# EAGLE schematic 519_jetson_nano_020100 (EAGLE 9.6.2)
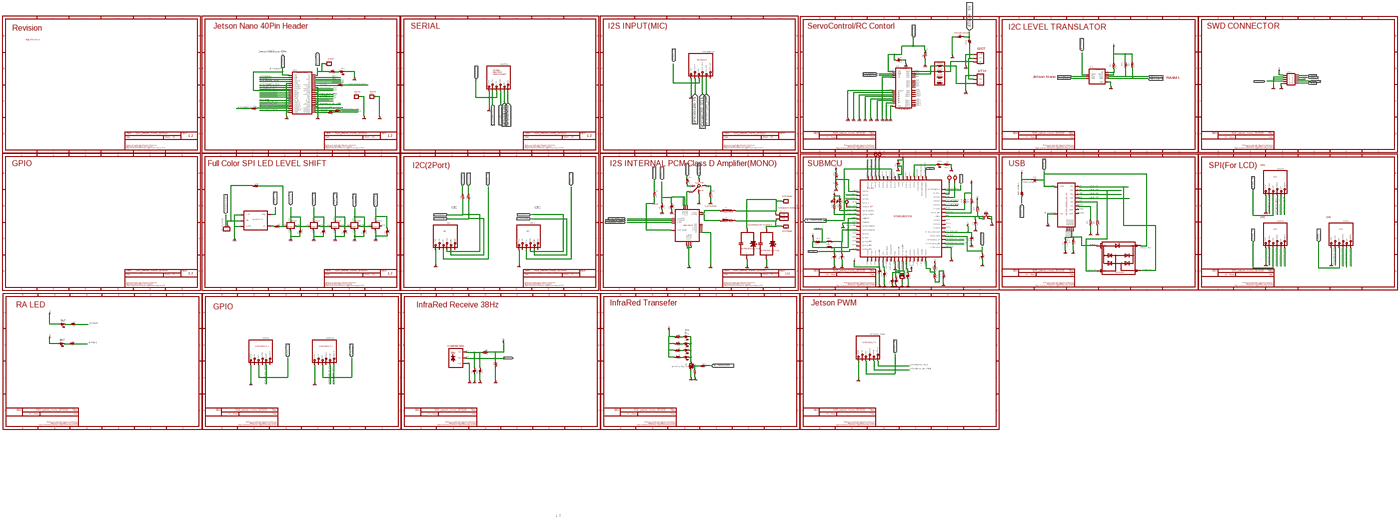
[diagram p0: schematic, sheet 1, overview]
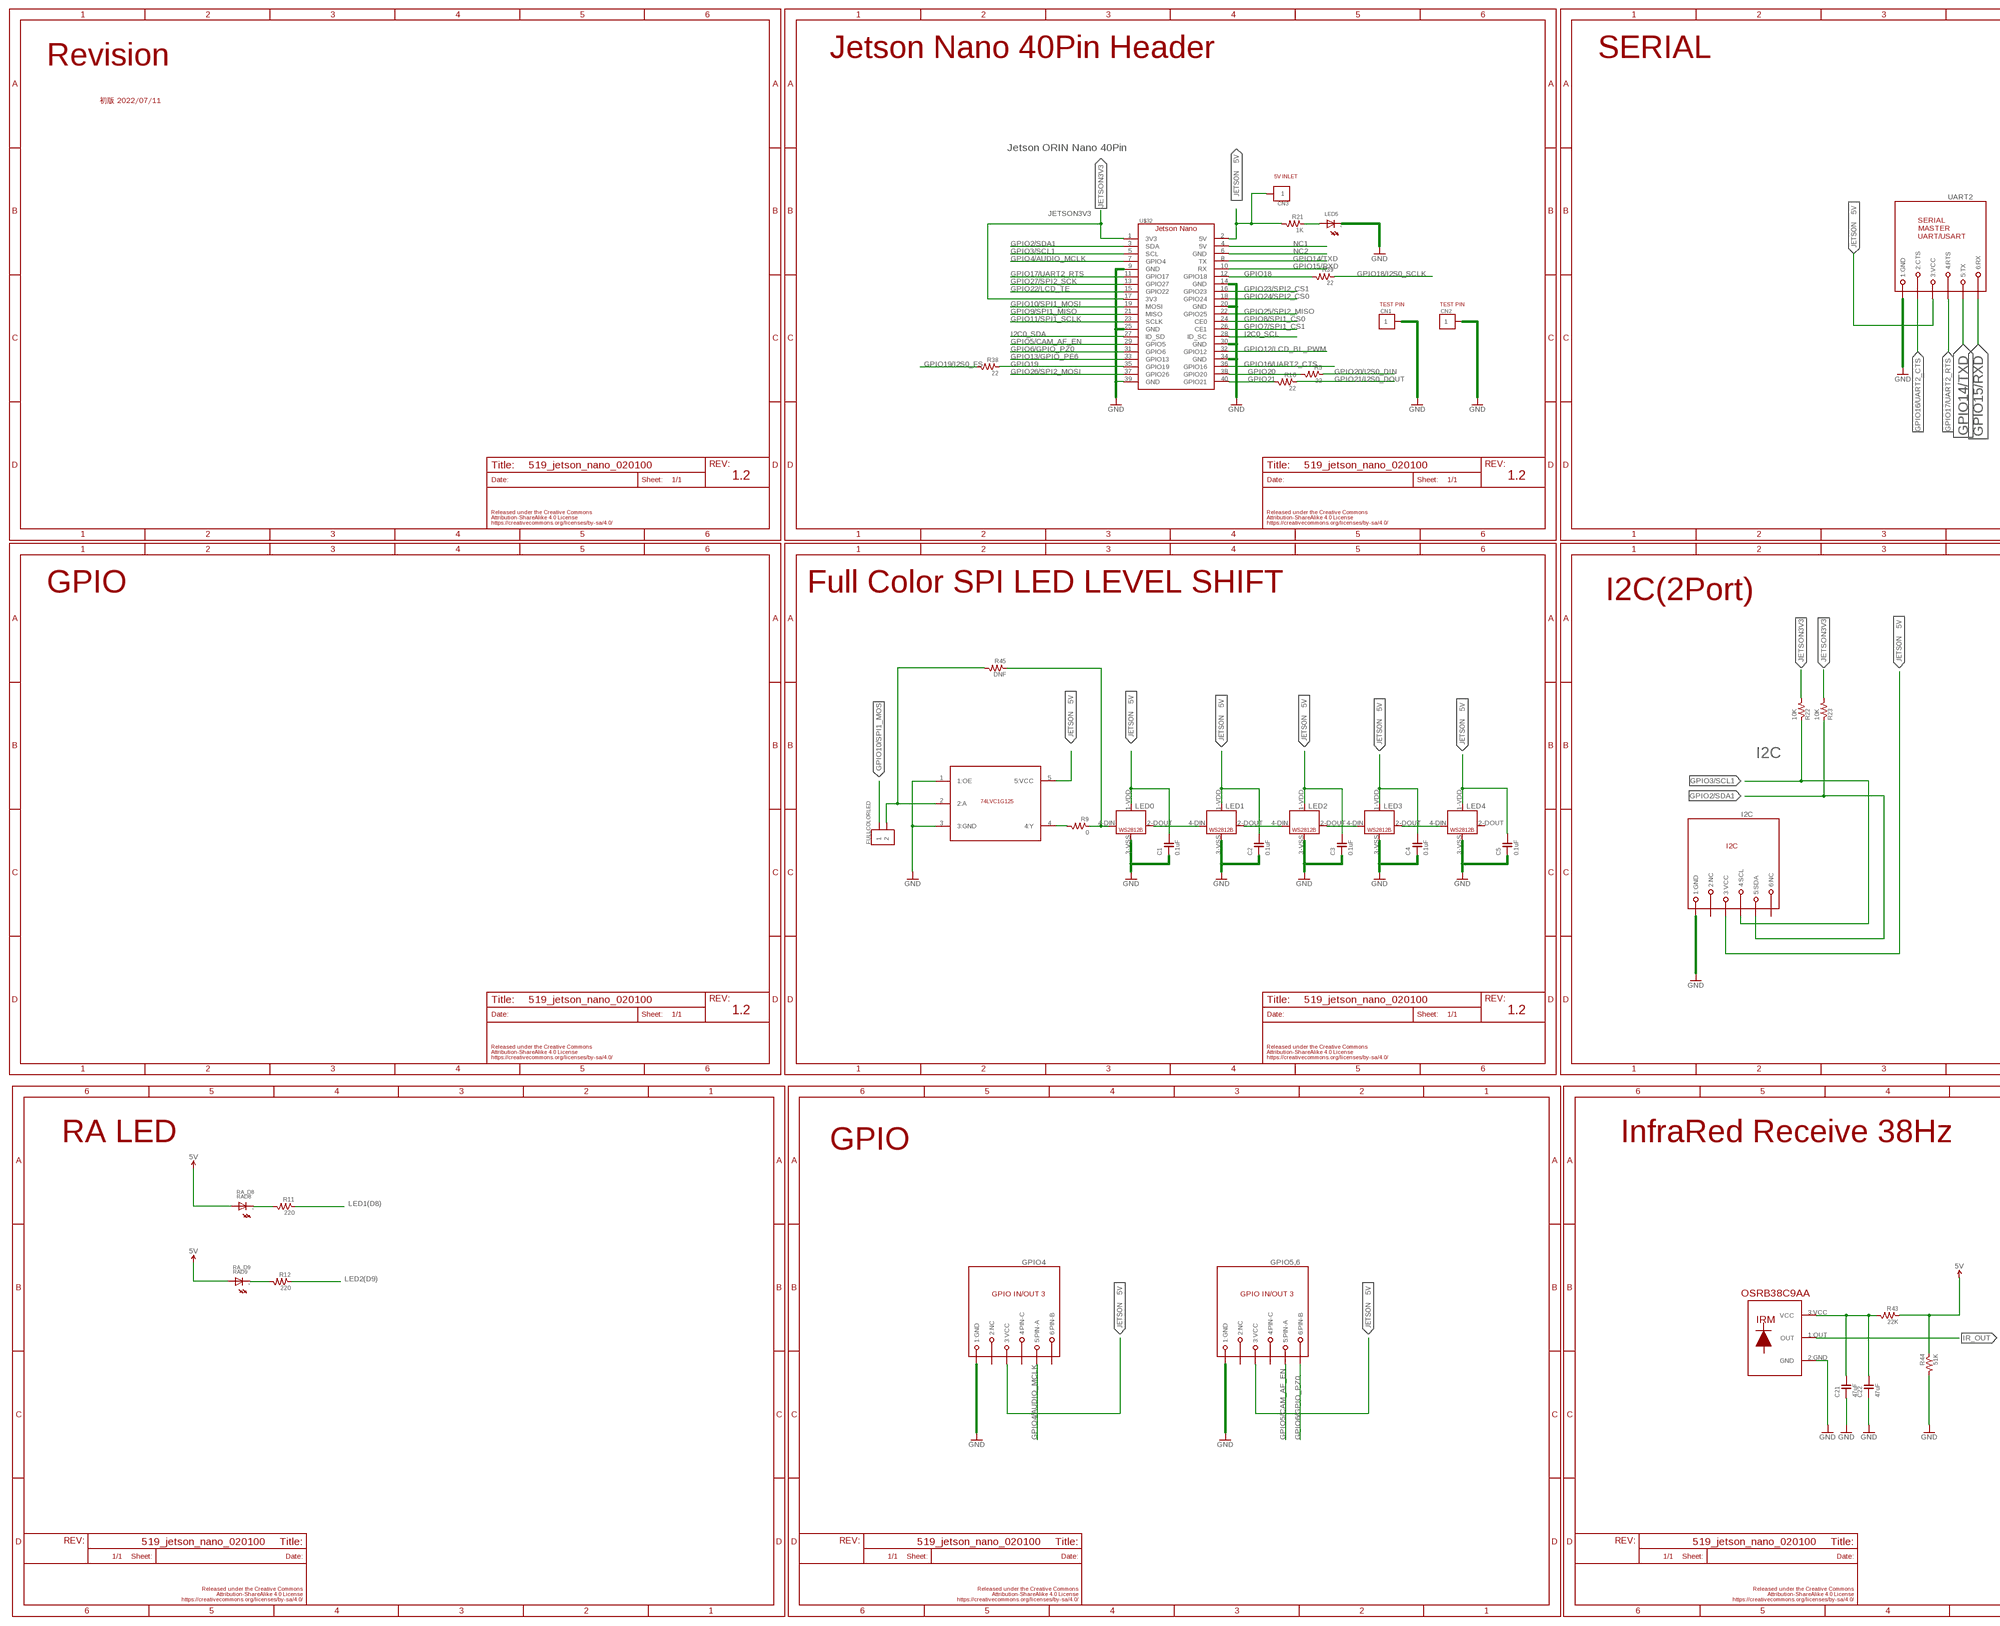
[diagram p1: schematic, sheet 1, part 1 of 4]
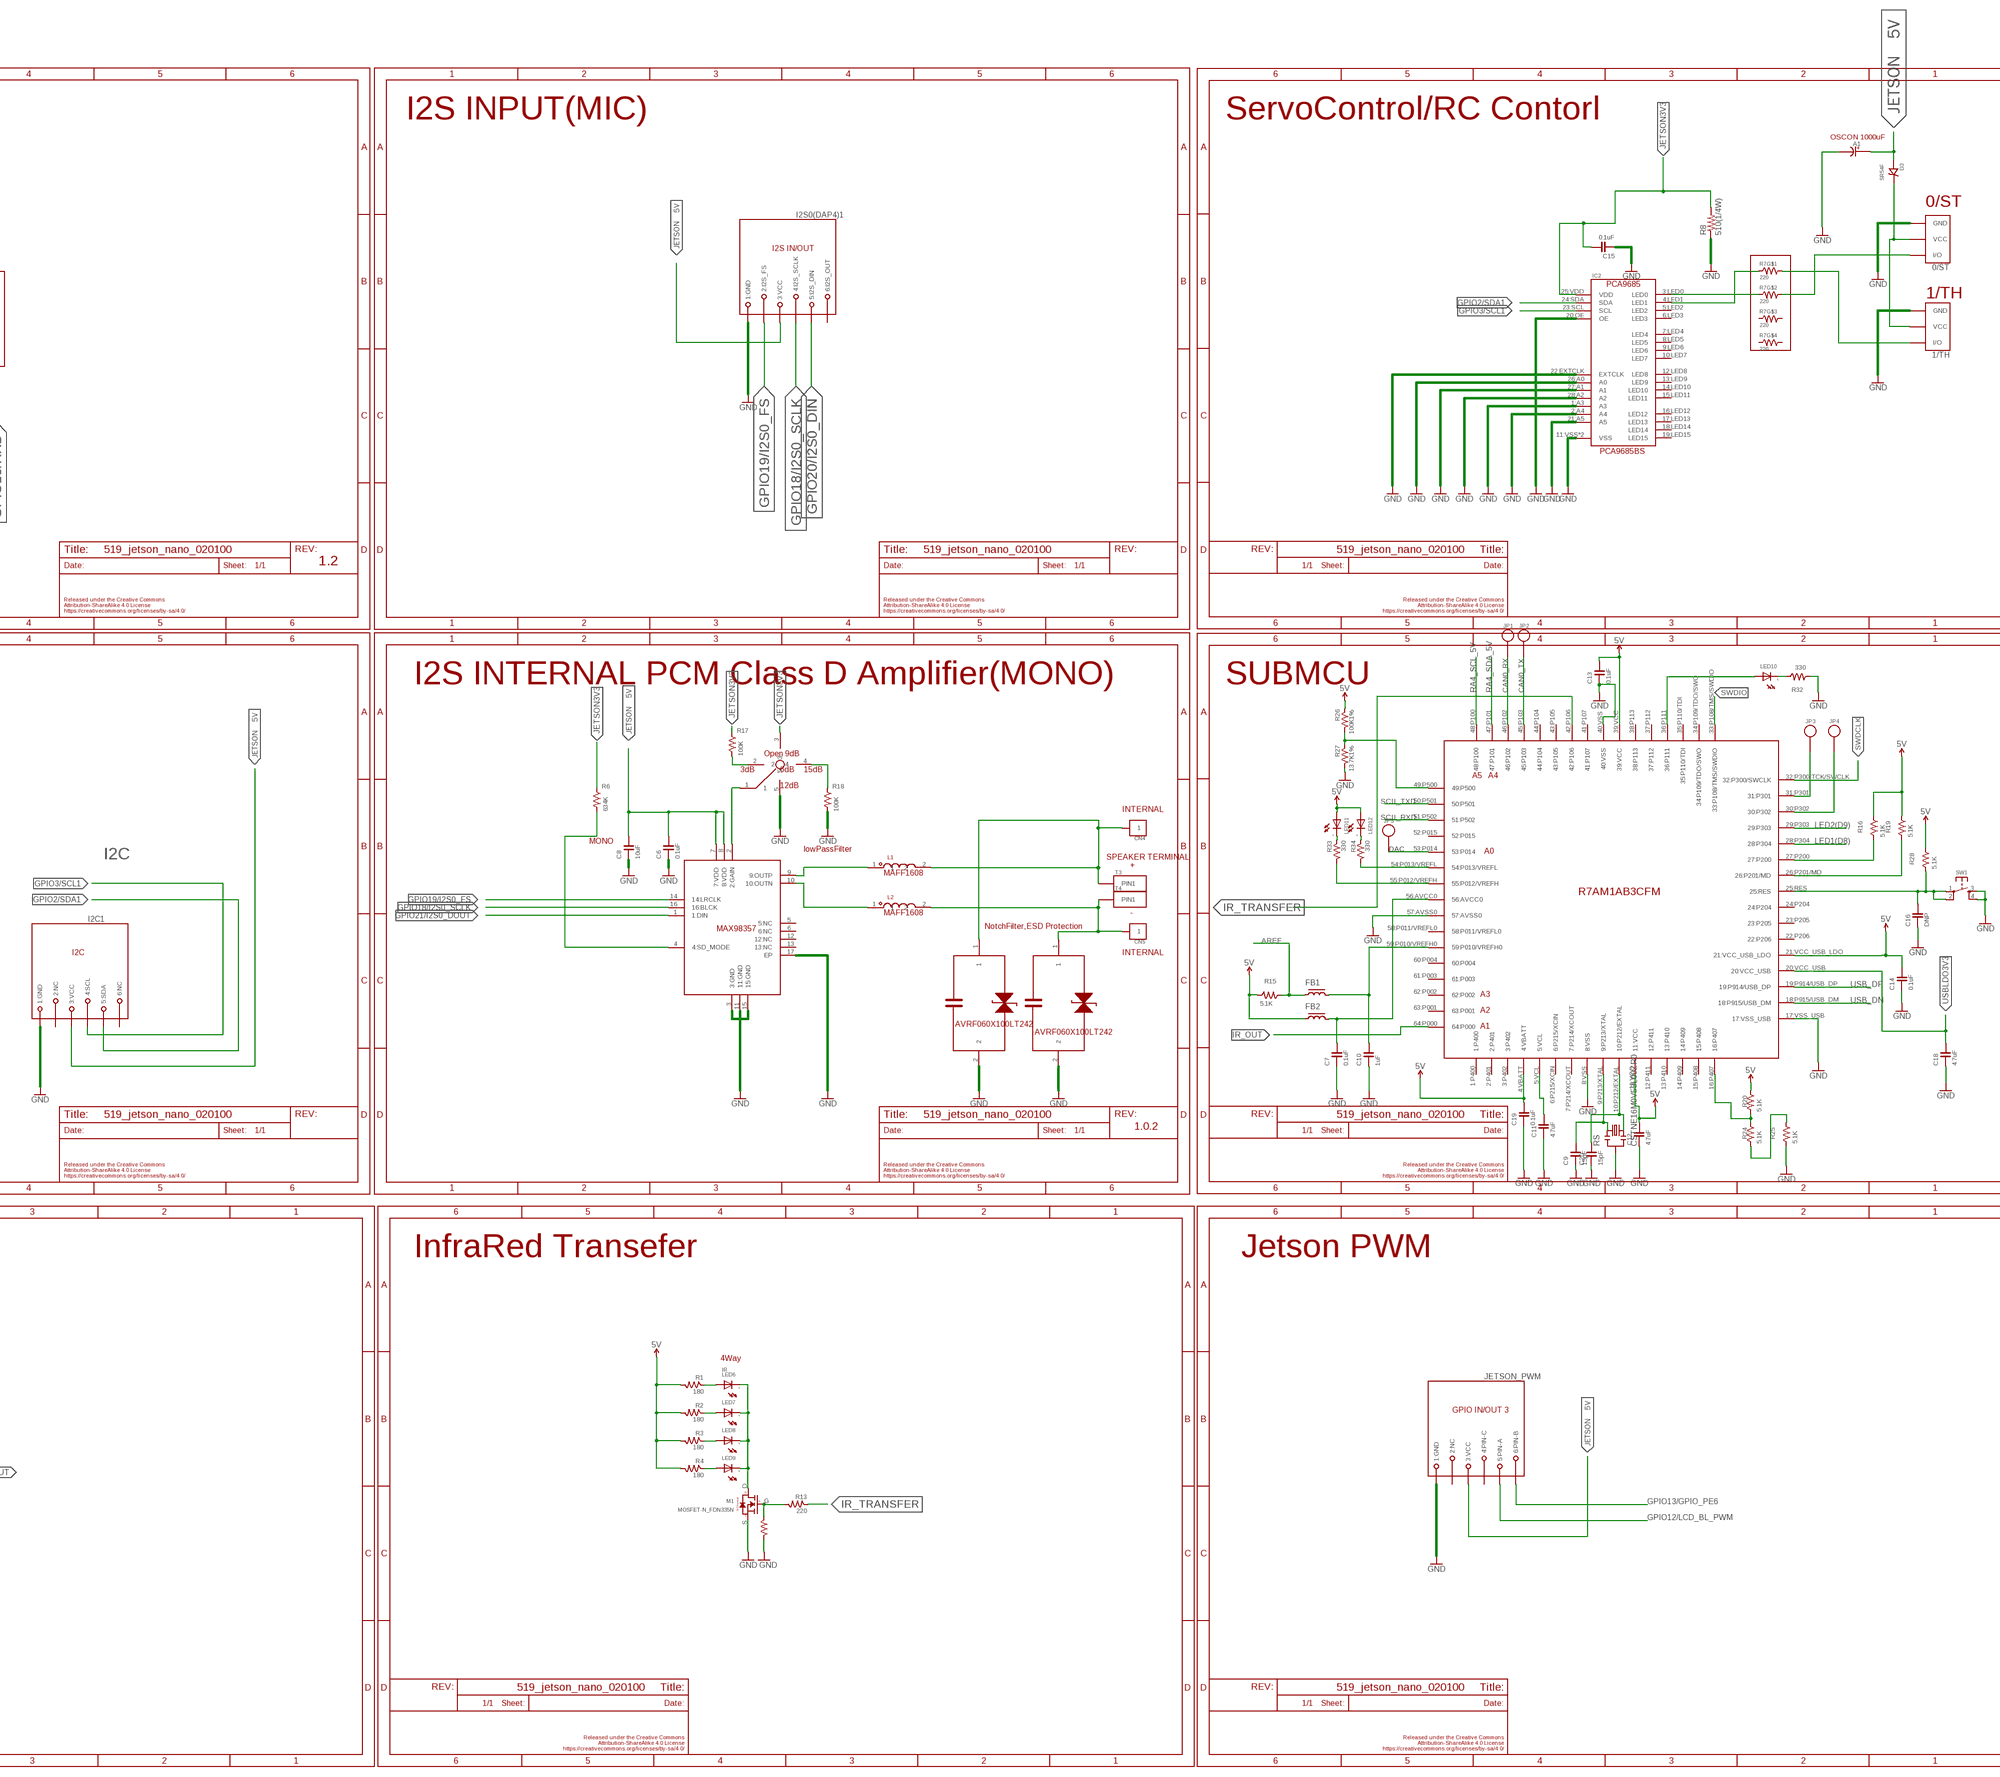
[diagram p2: schematic, sheet 1, part 2 of 4]
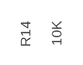
[diagram p3: schematic, sheet 1, part 3 of 4]
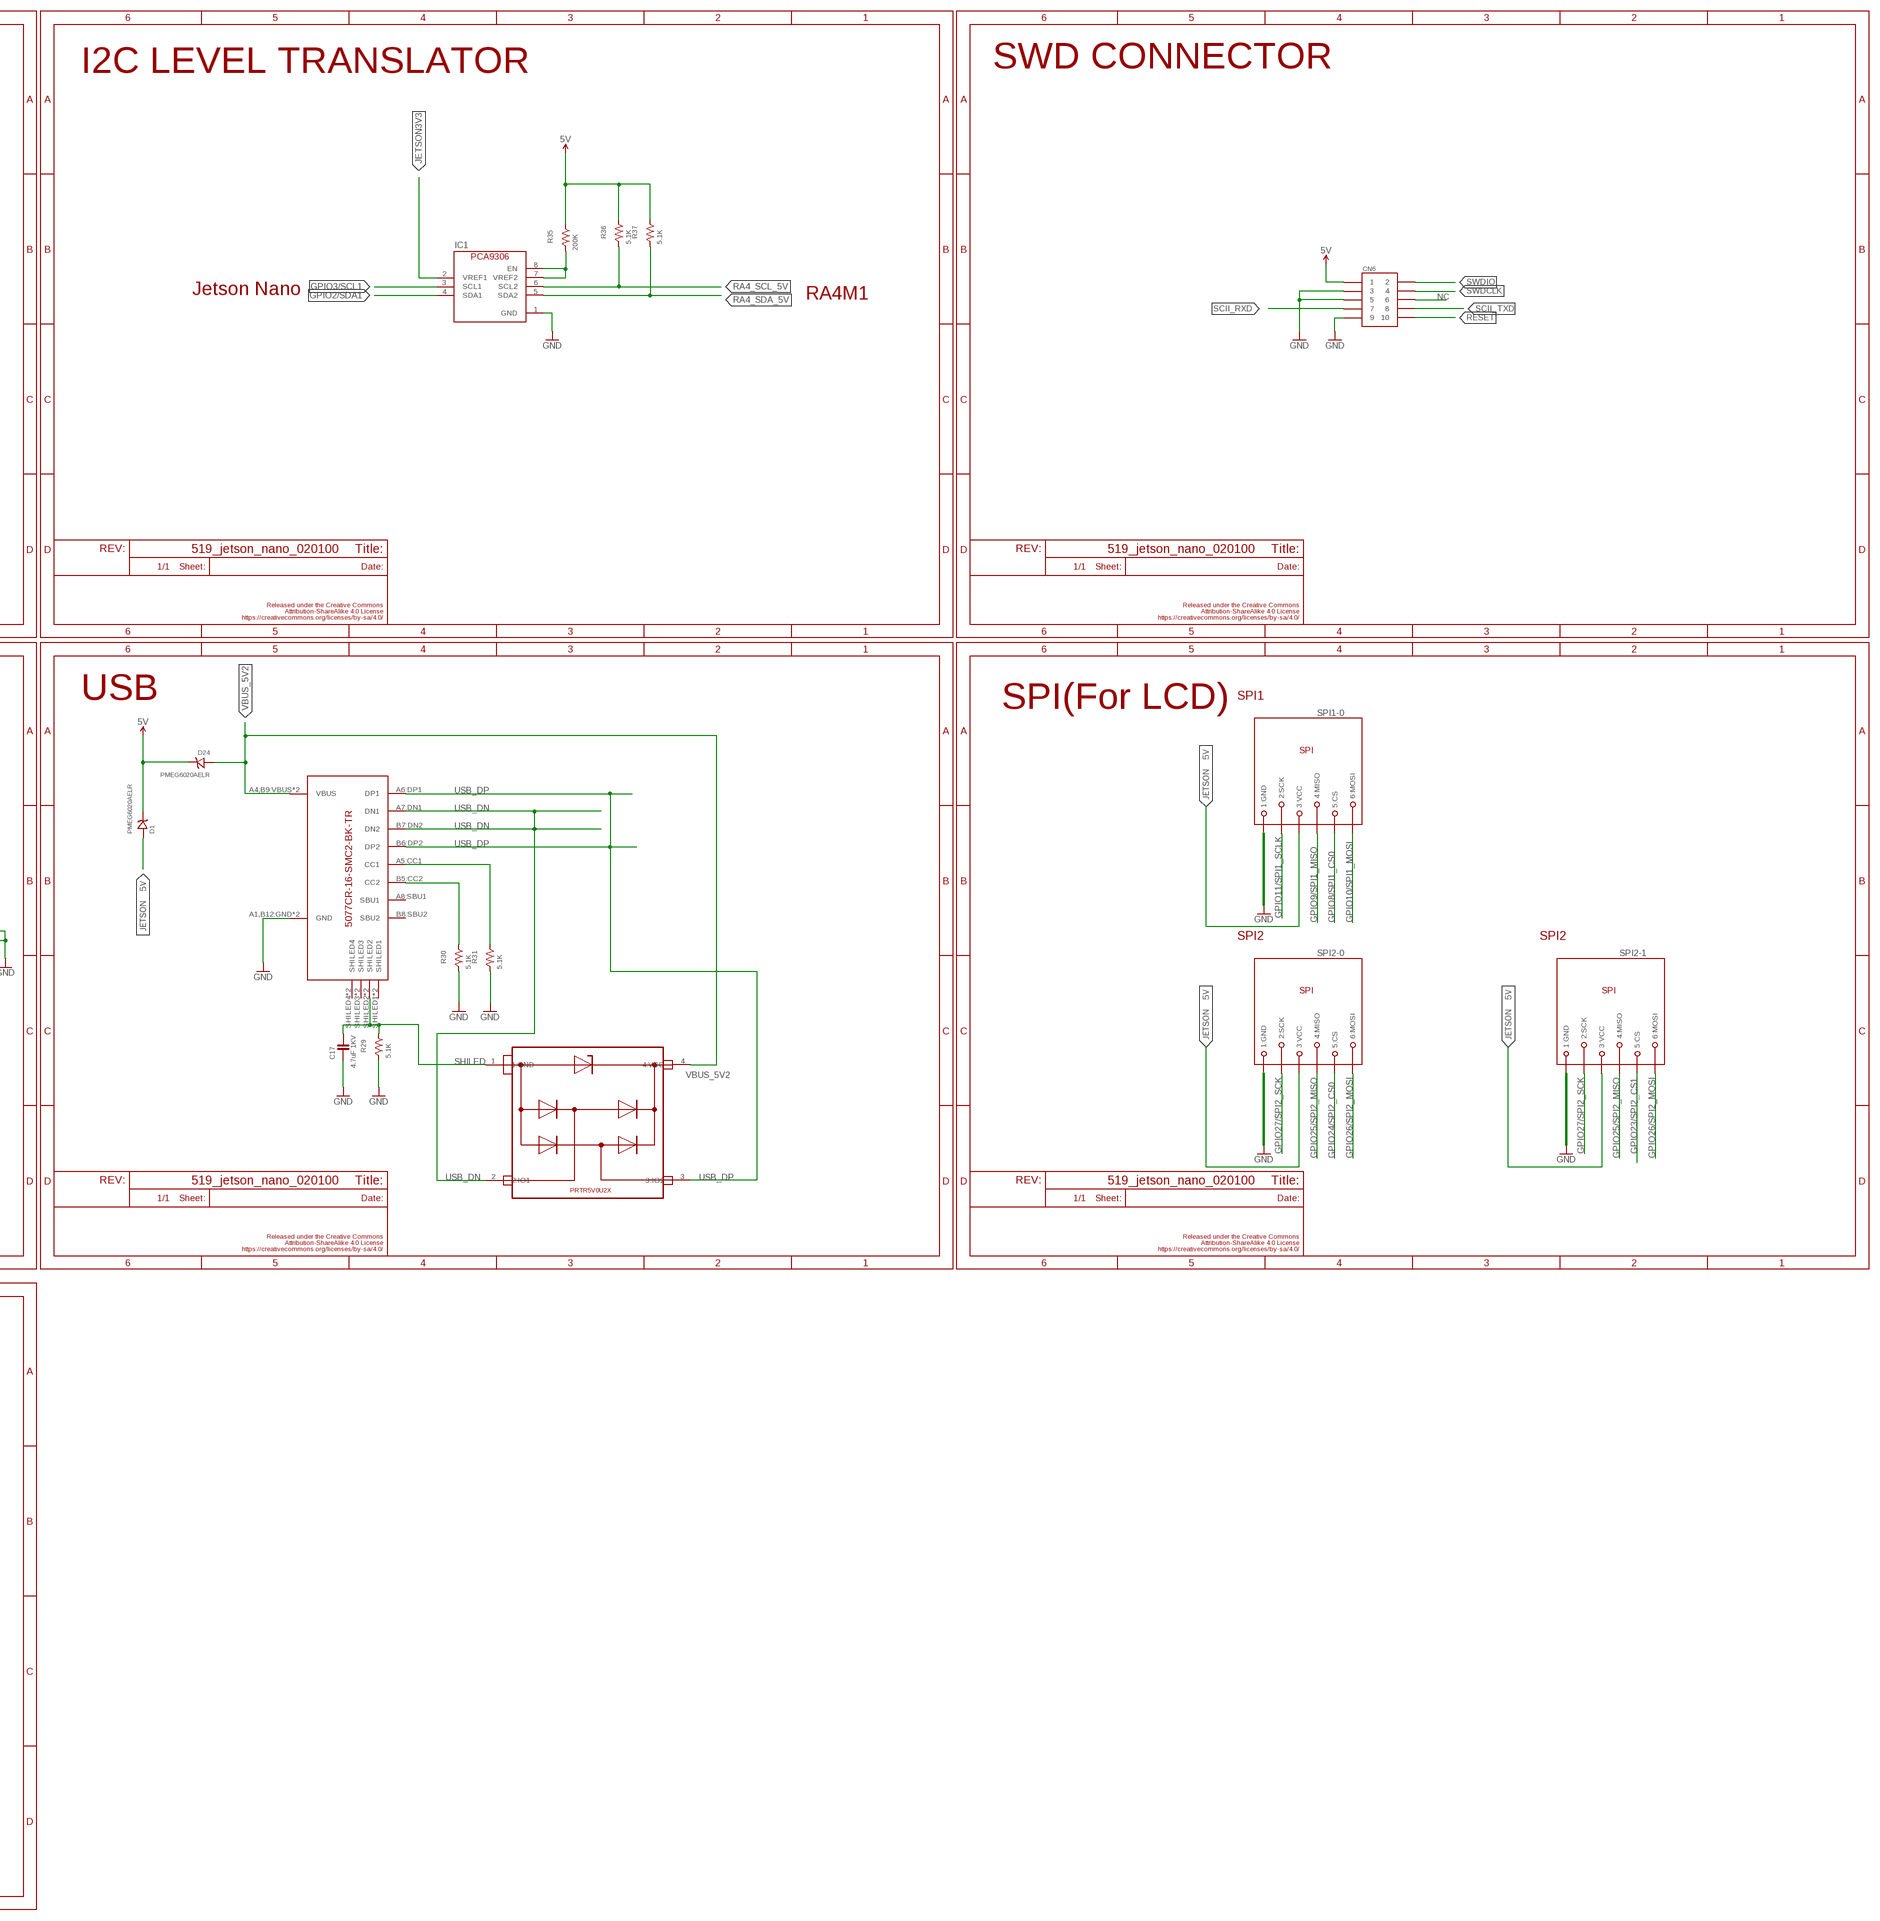
[diagram p4: schematic, sheet 1, part 4 of 4]

## Parts
0/ST  FABO_BRICK_3PIN-HEADER  [FABO_BRICK_3PIN_HEADER]
1/TH  FABO_BRICK_3PIN-HEADER  [FABO_BRICK_3PIN_HEADER]
A1  CAPACITOR-OS-CON  [F13]
C1  0.1uF  CAPACITOR-0603_NARROW  [0603-NARROW]
C2  0.1uF  CAPACITOR-0603_NARROW  [0603-NARROW]
C3  0.1uF  CAPACITOR-0603_NARROW  [0603-NARROW]
C4  0.1uF  CAPACITOR-0603_NARROW  [0603-NARROW]
C5  0.1uF  CAPACITOR-0603_NARROW  [0603-NARROW]
C6  0.1uF  CAPACITOR-0603  [0603]
C7  0.1uF  CAPACITOR-0603  [0603]
C8  10uF  CAPACITOR-0603  [0603]
C9  15pF  CAPACITOR-0603  [0603]
C10  1uF  CAPACITOR-0603  [0603]
C11  4.7uF  CAPACITOR-0603  [0603]
C12  4.7uF  CAPACITOR-0603  [0603]
C13  0.1uF  CAPACITOR-0603  [0603]
C14  0.1uF  CAPACITOR-0603  [0603]
C15  0.1uF  CAPACITOR-0603  [0603]
C16  DNP  CAPACITOR-0603  [0603]
C17  4.7uF 1KV  CAPACITOR-0603  [0603]
C18  4.7uF  CAPACITOR-0603  [0603]
C19  0.1uF  CAPACITOR-0603  [0603]
C20  15pF  CAPACITOR-0603  [0603]
C21  47uF  CAPACITOR-0603_NARROW  [0603-NARROW]
C22  47uF  CAPACITOR-0603_NARROW  [0603-NARROW]
CN1  PIN_1X1-SMALL  [PIN_1X1_SMALL]
CN2  PIN_1X1-SMALL  [PIN_1X1_SMALL]
CN3  PIN_1X1-SMALL  [PIN_1X1_SMALL]
CN4  PIN_1X1-SMALL  [PIN_1X1_SMALL]
CN5  PIN_1X1-SMALL  [PIN_1X1_SMALL]
CN6  PIN-HEADER-SMT(1.27MM)2X5  [PIN-HEADER-SMT(1.27MM)2X5]
D1  PMEG6020AELR  [SOD123W]
D3  SR54F  [SMBF]
D24  PMEG6020AELR  [SOD123W]
FB1  FERRITEBEADS  [0603]
FB2  FERRITEBEADS  [0603]
FULLCOLORLED  PIN_1X2  [PIN_1X2]
GPIO4  MODULAR-JACK-6P-RJ11_GPIO3  [7002-6PXC-X]
GPIO5,6  MODULAR-JACK-6P-RJ11_GPIO3  [7002-6PXC-X]
I2C  MODULAR-JACK-6P-RJ11_I2C  [7002-6PXC-X]
I2C1  MODULAR-JACK-6P-RJ11_I2C  [7002-6PXC-X]
I2S0(DAP4)1  MODULAR-JACK-6P-RJ11_I2S_MASTER  [7002-6PXC-X]
IC1  PCA9306_SSOP  [8PIN-SSOP]
IC2  PCA9685BSPCA9685BS  [HVQFN28]
JETSON_PWM  MODULAR-JACK-6P-RJ11_GPIO3  [7002-6PXC-X]
JP1  PIN_1X1_NOLABEL  [PIN_1X1_NOLABEL]
JP2  PIN_1X1_NOLABEL  [PIN_1X1_NOLABEL]
JP3  PIN_1X1_NOLABEL  [PIN_1X1_NOLABEL]
JP4  PIN_1X1_NOLABEL  [PIN_1X1_NOLABEL]
JP5  PIN_1X1_NOLABEL  [PIN_1X1_NOLABEL]
L1  MAF1608F  [1608MM]
L2  MAF1608F  [1608MM]
LED0  WS2812B_NARROW  [WS2812B_NARROW]
LED1  WS2812B_NARROW  [WS2812B_NARROW]
LED2  WS2812B_NARROW  [WS2812B_NARROW]
LED3  WS2812B_NARROW  [WS2812B_NARROW]
LED4  WS2812B_NARROW  [WS2812B_NARROW]
LED5  LED-0603  [0603]
LED6  IR  LED-5MM  [LED_5MM]
LED7  LED-5MM  [LED_5MM]
LED8  LED-5MM  [LED_5MM]
LED9  LED-5MM  [LED_5MM]
LED10  LED-0603  [0603]
LED11  LED-0603  [0603]
LED12  LED-0603  [0603]
M1  MOSFET-N_FDN335N  [SUPERSOT-3]
M2  OSRB38C9AA  [OSRB38C9AA]
R1  180  RESISTOR-0603  [0603]
R2  180  RESISTOR-0603  [0603]
R3  180  RESISTOR-0603  [0603]
R4  180  RESISTOR-0603  [0603]
R5  22  RESISTOR-0603  [0603]
R6  634K  RESISTOR-0603  [0603]
R7  220  RESISTOR_ARRAY  [EXBV8V]
R8  510(1/4W)  R-US_R0805  [R0805]
R9  0  RESISTOR-0603  [0603]
R10  22  RESISTOR-0603  [0603]
R11  220  RESISTOR-0603  [0603]
R12  220  RESISTOR-0603  [0603]
R13  220  RESISTOR-0603  [0603]
R14  10K  RESISTOR-0603  [0603]
R15  5.1K  RESISTOR-0603  [0603]
R16  5.1K  RESISTOR-0603  [0603]
R17  100K  RESISTOR-0603  [0603]
R18  100K  RESISTOR-0603  [0603]
R19  5.1K  RESISTOR-0603  [0603]
R20  5.1K  RESISTOR-0603  [0603]
R21  1K  RESISTOR-0603  [0603]
R22  10K  RESISTOR-0603  [0603]
R23  10K  RESISTOR-0603  [0603]
R24  5.1K  RESISTOR-0603  [0603]
R25  5.1K  RESISTOR-0603  [0603]
R26  100K1%  RESISTOR-0603  [0603]
R27  13.7K1%  RESISTOR-0603  [0603]
R28  5.1K  RESISTOR-0603  [0603]
R29  5.1K  RESISTOR-0603  [0603]
R30  5.1K  RESISTOR-0603  [0603]
R31  5.1K  RESISTOR-0603  [0603]
R32  330  RESISTOR-0603  [0603]
R33  330  RESISTOR-0603  [0603]
R34  330  RESISTOR-0603  [0603]
R35  200K  RESISTOR-0603  [0603]
R36  5.1K  RESISTOR-0603  [0603]
R37  5.1K  RESISTOR-0603  [0603]
R38  22  RESISTOR-0603  [0603]
R39  22  RESISTOR-0603  [0603]
R43  22K  RESISTOR-0603  [0603]
R44  51K  RESISTOR-0603  [0603]
R45  DNF  RESISTOR-0603  [0603]
RAD8  RA_D8  LED-5MM  [LED_5MM]
RAD9  RA_D9  LED-5MM  [LED_5MM]
RS  CSTNE16M0V53L00ZR0  [3-SMD]
SPI1-0  MODULAR-JACK-6P-RJ11_SPI  [7002-6PXC-X]
SPI2-0  MODULAR-JACK-6P-RJ11_SPI  [7002-6PXC-X]
SPI2-1  MODULAR-JACK-6P-RJ11_SPI  [7002-6PXC-X]
SW1  TACT-SWITCH-SMD_KMR2  [KMR2]
T3  TBL004-508  [TBL004-508]
T4  TBL004-508  [TBL004-508]
U$11  AVRF060X100LT242  [AVRF0X0X100LT_0603]
U$12  AVRF060X100LT242  [AVRF0X0X100LT_0603]
U$13  MAX98357A,B  [TQFN(16L3*3*0.75)]
U$14  2MMJUMPER_CROSS  [PINHEAD2MM_CROSS]
U$19  R7FA4M1AB3CFM  [LQFP-64_RENESAS]
U$22  5077CR-16-SMC2-BK-TR  [5077CR-16-SMC2-BK-TR]
U$23  PRTR5V0U2X  [SOT143B]
U$28  74LVC1G125  [TSOP5(SOT753)]
U$32  JETSON_NANOJETSON_NANO_OVERALL  [JETSON_NANO_DEMENTION]
UART2  MODULAR-JACK-6P-RJ11_SERIAL_M_USART  [7002-6PXC-X]

## Nets
3DB: R17.2 U$14.2
5V: C12.2 C13.2 C14.2 C19.2 CN6.1 D1.1(CATHODE) D24.1(CATHODE) FB2.1 LED11.ANODE LED12.ANODE R1.2 R2.2 R3.2 R4.2 R15.2 R16.1 R19.1 R20.1 R26.1 R28.1 R35.1 R36.1 R37.1 R43.1 R44.1 RAD8.A(ANODE) RAD9.A(ANODE) U$19.4:VBATT U$19.11:VCC U$19.21:VCC_USB_LDO U$19.39:VCC
15DB: R18.1 U$14.4
AREF: FB1.1 R15.1
CAN0_RX: JP1.1 U$19.46:P102
CAN0_TX: JP2.1 U$19.45:P103
DAC: JP5.1 U$19.53:P014
GAIN: U$13.2(2:GAIN) U$14.1
GND [New Class]: 0/ST.GND 1/TH.GND A1.CATHODE(-) C1.1 C2.1 C3.1 C4.1 C5.1 C6.1 C7.1 C8.1 C9.1 C10.1 C11.1 C12.1 C13.1 C14.1 C15.1 C16.1 C17.1 C18.1 C19.1 C20.1 C21.1 C22.1 CN1.1 CN2.1 CN6.3 CN6.5 CN6.9 GPIO4.1(1:GND) GPIO5,6.1(1:GND) I2C1.1(1:GND) I2C.1(1:GND) I2S0(DAP4)1.1(1:GND) IC1.1(GND) IC2.1:A3(A3) IC2.2:A4(A4) IC2.11:VSS(VSS) IC2.20:OE(OE) IC2.21:A5(A5) IC2.22:EXTCLK(EXTCLK) IC2.26:A0(A0) IC2.27:A1(A1) IC2.28:A2(A2) IC2.29(VSS) JETSON_PWM.1(1:GND) LED0.3-VSS(VSS) LED1.3-VSS(VSS) LED2.3-VSS(VSS) LED3.3-VSS(VSS) LED4.3-VSS(VSS) LED5.CATHODE M1.S M2.2:GND(GND) R8.1 R14.2 R18.2 R25.2 R27.2 R29.2 R30.2 R31.2 R32.2 R44.2 RS.2:GND SPI1-0.1(1:GND) SPI2-0.1(1:GND) SPI2-1.1(1:GND) SW1.3 SW1.4 U$11.2 U$12.2 U$13.3(3:GND) U$13.11(11:GND) U$13.15(15:GND) U$13.17(EP) U$14.5 U$19.8:VSS U$19.17:VSS_USB U$19.40:VSS U$19.57:AVSS0 U$22.A1,B12:GND(GND) U$22.B1,A12:GND(GND) U$28.1(1:OE) U$28.3(3:GND) U$32.9(GND) U$32.14(GND) U$32.20(GND) U$32.25(GND) U$32.30(GND) U$32.34(GND) U$32.39(GND) UART2.1(1:GND)
GPIO2/SDA1 [New Class]: I2C1.5(5:SDA) I2C.5(5:SDA) IC1.4(SDA1) IC2.24:SDA(SDA) R23.1 U$32.3(SDA)
GPIO3/SCL1 [New Class]: I2C1.4(4:SCL) I2C.4(4:SCL) IC1.3(SCL1) IC2.23:SCL(SCL) R22.1 U$32.5(SCL)
GPIO4/AUDIO_MCLK [New Class]: GPIO4.5(5:PIN-A) U$32.7(GPIO4)
GPIO5/CAM_AF_EN [New Class]: GPIO5,6.5(5:PIN-A) U$32.29(GPIO5)
GPIO6/GPIO_PZ0 [New Class]: GPIO5,6.6(6:PIN-B) U$32.31(GPIO6)
GPIO7/SPI1_CS1 [New Class]: U$32.26(CE1)
GPIO8/SPI1_CS0 [New Class]: SPI1-0.5(5:CS) U$32.24(CE0)
GPIO9/SPI1_MISO [New Class]: SPI1-0.4(4:MISO) U$32.21(MISO)
GPIO10/SPI1_MOSI [New Class]: FULLCOLORLED.1 SPI1-0.6(6:MOSI) U$32.19(MOSI)
GPIO11/SPI1_SCLK [New Class]: SPI1-0.2(2:SCK) U$32.23(SCLK)
GPIO12/LCD_BL_PWM [New Class]: JETSON_PWM.5(5:PIN-A) U$32.32(GPIO12)
GPIO13/GPIO_PE6 [New Class]: JETSON_PWM.6(6:PIN-B) U$32.33(GPIO13)
GPIO14/TXD [New Class]: U$32.8(TX) UART2.5(5:TX)
GPIO15/RXD [New Class]: U$32.10(RX) UART2.6(6:RX)
GPIO16/UART2_CTS [New Class]: U$32.36(GPIO16) UART2.2(2:CTS)
GPIO17/UART2_RTS [New Class]: U$32.11(GPIO17) UART2.4(4:RTS)
GPIO18 [New Class]: R39.2 U$32.12(GPIO18)
GPIO18/I2S0_SCLK [New Class]: I2S0(DAP4)1.4(4:I2S_SCLK) R39.1 U$13.16(16:BLCK)
GPIO19: R38.1 U$32.35(GPIO19)
GPIO19/I2S0_FS [New Class]: I2S0(DAP4)1.2(2:I2S_FS) R38.2 U$13.14(14:LRCLK)
GPIO20: R5.2 U$32.38(GPIO20)
GPIO20/I2S0_DIN [New Class]: I2S0(DAP4)1.5(5:I2S_DIN) R5.1
GPIO21: R10.2 U$32.40(GPIO21)
GPIO21/I2S0_DOUT [New Class]: R10.1 U$13.1(1:DIN)
GPIO22/LCD_TE [New Class]: U$32.15(GPIO22)
GPIO23/SPI2_CS1 [New Class]: SPI2-1.5(5:CS) U$32.16(GPIO23)
GPIO24/SPI2_CS0 [New Class]: SPI2-0.5(5:CS) U$32.18(GPIO24)
GPIO25/SPI2_MISO [New Class]: SPI2-0.4(4:MISO) SPI2-1.4(4:MISO) U$32.22(GPIO25)
GPIO26/SPI2_MOSI [New Class]: SPI2-0.6(6:MOSI) SPI2-1.6(6:MOSI) U$32.37(GPIO26)
GPIO27/SPI2_SCK [New Class]: SPI2-0.2(2:SCK) SPI2-1.2(2:SCK) U$32.13(GPIO27)
I2C0_SCL [New Class]: U$32.28(ID_SC)
I2C0_SDA [New Class]: U$32.27(ID_SD)
IR_OUT: M2.1:OUT(OUT) U$19.64:P000
IR_TRANSFER: R13.1 U$19.42:P106
JETSON3V3 [New Class]: C15.2 IC1.2(VREF1) IC2.25:VDD(VDD) R6.1 R8.2 R17.1 R22.2 R23.2 U$14.3 U$32.1(3V3) U$32.17(3V3)
JETSON　5V [New Class]: A1.ANODE(+) C1.2 C2.2 C3.2 C4.2 C5.2 C6.2 C8.2 CN3.1 D1.2(ANODE) D3.ANODE GPIO4.3(3:VCC) GPIO5,6.3(3:VCC) I2C1.3(3:VCC) I2C.3(3:VCC) I2S0(DAP4)1.3(3:VCC) JETSON_PWM.3(3:VCC) LED0.1-VDD(VDD) LED1.1-VDD(VDD) LED2.1-VDD(VDD) LED3.1-VDD(VDD) LED4.1-VDD(VDD) R21.2 SPI1-0.3(3:VCC) SPI2-0.3(3:VCC) SPI2-1.3(3:VCC) U$13.7(7:VDD) U$13.8(8:VDD) U$28.5(5:VCC) U$32.2(5V) UART2.3(3:VCC)
LED1(D8): R11.1 U$19.28:P304
LED2(D9): R12.1 U$19.29:P303
MONO: R6.2 U$13.4(4:SD_MODE)
N$1: LED0.2-DOUT(DOUT) LED1.4-DIN(DIN)
N$2: LED6.A(ANODE) R1.1
N$3: LED8.A(ANODE) R3.1
N$4: LED9.A(ANODE) R4.1
N$5: LED5.ANODE R21.1
N$6: LED1.2-DOUT(DOUT) LED2.4-DIN(DIN)
N$7: IC2.4:LED1(LED1) R7.1
N$8: LED2.2-DOUT(DOUT) LED3.4-DIN(DIN)
N$9: LED3.2-DOUT(DOUT) LED4.4-DIN(DIN)
N$10: IC2.3:LED0(LED0) R7.2
N$11: LED6.K(CATHODE) LED7.K(CATHODE) LED8.K(CATHODE) LED9.K(CATHODE) M1.D
N$12: 0/ST.I/O R7.7
N$13: 1/TH.I/O R7.8
N$14: M1.G R13.2 R14.1
N$15 [New Class]: LED0.4-DIN(DIN) R9.1 R45.1
N$16: LED7.A(ANODE) R2.1
N$17: R9.2 U$28.4(4:Y)
N$18: C9.2 RS.1:INPUT U$19.9:P213/XTAL
N$19: C10.2 FB1.2 U$19.59:P010/VREFH0
N$20: C7.2 FB2.2 U$19.56:AVCC0
N$21: C20.2 RS.3:OUTPUT U$19.10:P212/EXTAL
N$22: C11.2 U$19.5:VCL
N$23: R16.2 U$19.27:P200
N$24: R19.2 U$19.26:P201/MD
N$25: R24.2 R25.1
N$26: R20.2 R24.1 U$19.16:P407
N$27: 0/ST.VCC 1/TH.VCC D3.CATHODE
N$28: R26.2 R27.1 U$19.49:P500
N$29: JP3.1 U$19.31:P301
N$30: R30.1 U$22.B5:CC2(CC2)
N$31: R31.1 U$22.A5:CC1(CC1)
N$32: LED10.CATHODE R32.1
N$33: LED10.ANODE U$19.36:P111
N$34: R34.2 U$19.54:P013/VREFL
N$35: R33.2 U$19.55:P012/VREFH
N$36: LED11.CATHODE R33.1
N$37: LED12.CATHODE R34.1
N$38: IC1.7(VREF2) IC1.8(EN) R35.2
N$39: C21.2 C22.2 M2.3:VCC(VCC) R43.2
N$40: JP4.1 U$19.30:P302
N$41: FULLCOLORLED.2 R45.2 U$28.2(2:A)
N$43: R12.2 RAD9.K(CATHODE)
N$44: R11.2 RAD8.K(CATHODE)
NC: CN6.6
NC1 [New Class]: U$32.4(5V)
NC2 [New Class]: U$32.6(GND)
OUTN: L2.1 U$13.10(10:OUTN)
OUTP: L1.1 U$13.9(9:OUTP)
RA4_SCL_5V: IC1.6(SCL2) R36.2 U$19.48:P100
RA4_SDA_5V: IC1.5(SDA2) R37.2 U$19.47:P101
RESET: C16.2 CN6.10 R28.2 SW1.1 SW1.2 U$19.25:RES
SCII_RXD: CN6.7 U$19.51:P502
SCII_TXD: CN6.8 U$19.50:P501
SHILED: C17.2 R29.1 U$22.SHILED2 U$22.SHILED6(SHILED2) U$23.1(1:GND)
SP_MINUS: CN5.1 L2.2 T4.P$1(PIN1) T4.P$2(PIN1) U$12.1
SP_PLUS: CN4.1 L1.2 T3.P$1(PIN1) T3.P$2(PIN1) U$11.1
SWDCLK: CN6.4 U$19.32:P300/TCK/SWCLK(32:P300/SWCLK)
SWDIO: CN6.2 U$19.33:P108/TMS/SWDIO
USB_DN: U$19.18:P915/USB_DM U$22.A7:DN1(DN1) U$22.B7:DN2(DN2) U$23.2(2:IO1)
USB_DP: U$19.19:P914/USB_DP U$22.A6:DP1(DP1) U$22.B6:DP2(DP2) U$23.3(3:IO2)
USBLDO3V3: C18.2 U$19.20:VCC_USB
VBUS_5V2: D24.2(ANODE) U$22.A4,B9:VBUS(VBUS) U$22.B4,A9:VBUS(VBUS) U$23.4(4:VCC)
Unconnected: GPIO4.2(2:NC) GPIO4.4(4:PIN-C) GPIO4.6(6:PIN-B) GPIO5,6.2(2:NC) GPIO5,6.4(4:PIN-C) I2C1.2(2:NC) I2C1.6(6:NC) I2C.2(2:NC) I2C.6(6:NC) I2S0(DAP4)1.6(6:I2S_OUT) IC2.5:LED2(LED2) IC2.6:LED3(LED3) IC2.7:LED4(LED4) IC2.8:LED5(LED5) IC2.9:LED6(LED6) IC2.10:LED7(LED7) IC2.12:LED8(LED8) IC2.13:LED9(LED9) IC2.14:LED10(LED10) IC2.15:LED11(LED11) IC2.16:LED12(LED12) IC2.17:LED13(LED13) IC2.18:LED14(LED14) IC2.19:LED15(LED15) JETSON_PWM.2(2:NC) JETSON_PWM.4(4:PIN-C) LED4.2-DOUT(DOUT) R7.3 R7.4 R7.5 R7.6 U$13.5(5:NC) U$13.6(6:NC) U$13.12(12:NC) U$13.13(13:NC) U$19.1:P400 U$19.2:P401 U$19.3:P402 U$19.6:P215/XCIN U$19.7:P214/XCOUT U$19.12:P411 U$19.13:P410 U$19.14:P409 U$19.15:P408 U$19.22:P206 U$19.23:P205 U$19.24:P204 U$19.34:P109/TDO/SWO U$19.35:P110/TDI U$19.37:P112 U$19.38:P113 U$19.41:P107 U$19.43:P105 U$19.44:P104 U$19.52:P015 U$19.58:P011/VREFL0 U$19.60:P004 U$19.61:P003 U$19.62:P002 U$19.63:P001 U$22.A8:SBU1(SBU1) U$22.B8:SBU2(SBU2) U$22.SHILED1 U$22.SHILED3 U$22.SHILED4 U$22.SHILED5(SHILED1) U$22.SHILED7(SHILED3) U$22.SHILED8(SHILED4)

## Notes on the sheet
- Revision | Jetson Nano 40Pin Header | SERIAL | I2S INPUT(MIC) | ServoControl/RC Contorl | I2C LEVEL TRANSLATOR | SWD CONNECTOR
- OSCON 1000uF
- 初版 2022/07/11
- 0/ST
- Jetson ORIN Nano 40Pin
- 5V INLET
- 1/TH
- Jetson Nano | RA4M1
- TEST PIN | TEST PIN
- PCA9685BS
- 1.2 | 1.2 | 1.2
- GPIO | Full Color SPI LED LEVEL SHIFT | I2C(2Port) | I2S INTERNAL PCM Class D Amplifier(MONO) | SUBMCU | USB | SPI(For LCD) | SPI1
- Open 9dB
- 3dB | 6dB | 15dB
- A5 | A4
- 12dB
- INTERNAL
- MONO
- lowPassFilter | A0
- I2C | I2C | SPEAKER TERMINAL
- +
- MAFF1608
- SPI2 | SPI2
- MAFF1608 | -
- NotchFilter,ESD Protection
- INTERNAL
- A3
- A2
- AVRF060X100LT242 | A1
- AVRF060X100LT242
- 1.2 | 1.2 | 1.0.2
- RA LED | InfraRed Receive 38Hz | InfraRed Transefer | Jetson PWM
- GPIO
- 4Way
- OSRB38C9AA

## Library data of the parts
0/ST = FaBo-Template:FABO_BRICK_3PIN: FaBo Brick 3pin; SPICEPREFIX: J
1/TH = FaBo-Template:FABO_BRICK_3PIN: FaBo Brick 3pin
A1 = FaBo-Capacitor:CAPACITOR-OS-CON: Panasonic 16SEPF1000M 16V 1000uF ESR 12 Size F13
C1-C22 = FaBo-Capacitor:CAPACITOR: CAPACITOR
CN1-CN5 = FaBo-PIN:PIN_1X1
CN6 = FaBo-PIN:PIN-HEADER-SMT(1.27MM)2X5
D1 D24 = FaBo-Diode:PMEG6020AELR
D3 = FaBo-Diode:SR54F: SURFACE MOUNT SCHOTTKY BARRIER RECTIFIER 40V Volts 5 Amperes SMBF molded plastic Forwaord Voltage 0.55V DC Reverse Current 0.1mA
FB1 FB2 = FaBo-Coil:FERRITEBEADS
FULLCOLORLED = FaBo-PIN:PIN_1X2
GPIO4 GPIO5,6 JETSON_PWM = FaBo-Connetor:MODULAR-JACK-6P-RJ11_GPIO3
I2C I2C1 = FaBo-Connetor:MODULAR-JACK-6P-RJ11_I2C
I2S0(DAP4)1 = FaBo-Connetor:MODULAR-JACK-6P-RJ11_I2S_MASTER
IC1 = FaBo-LevelTranslator:PCA9306
IC2 = FaBo-Motor:PCA9685BS
JP1-JP5 = FaBo-PIN:PIN_1X1_NOLABEL
L1 L2 = FaBo-EMC:MAF1608F
LED0 LED1-LED4 = FaBo-LED:WS2812B_NARROW
LED5-LED12 RAD8 RAD9 = FaBo-LED:LED
M1 = FaBo-Mosfet:MOSFET-N
M2 = FaBo-IR:OSRB38C9AA
R1-R6 R9-R39 R43-R45 = FaBo-Resistors:RESISTOR: RESISTOR
R7 = component:RESISTOR_ARRAY
R8 = rcl:R-US_: RESISTOR, American symbol; SPICEPREFIX: R
RS = FaBo-Crystal:CSTNE16M0V53L00ZR0: 3.2X1.3 16.0MHZ RESONA
SPI1-0 SPI2-0 SPI2-1 = FaBo-Connetor:MODULAR-JACK-6P-RJ11_SPI
SW1 = FaBo-Switch:TACT-SWITCH: Part No Maker Datasheet Distributor 1273HA-160G-G SWITRONIC Catalog <http://www.switronic.com/uploads/images/A10.gif> Akizuki <http://akizukidenshi.com/catalog/g/gP-02561/> DTS-6-V Cosland DTS 6 Series <http://www.cosland.com/newproduct/DTS%20SERIES.pdf> Akizuki <http://akizukidenshi.com/catalog/g/gP-03647/> KMR2 C&K KMR2 SERIES <https://www.ckswitches.com/products/switches/product-details/Tactile/KMR2/> Octoparts Result <https://octopart.com/search?q=KMR2&start=0> TSHA-T-XB2-19E TOP UP INDUSTORY TSHA-T <http://www.top-up.com.tw/front/bin/ptdetail.phtml?Part=TSHA-T> Akizuki <http://akizukidenshi.com/catalog/g/gP-09361/>
T3 T4 = FaBo-Terminal:TBL004-508
U$11 U$12 = FaBo-Coil:AVRF060X100LT242: ESD Notch Filters For wireless audio equipment TDK AVRF series ESD protection and noise protechtion.
U$13 = FaBo-AudioIC:MAX98357A,B
U$14 = FaBo-PIN:2MMJUMPER_CROSS
U$19 = FaBo-MPU:R7FA4M1AB3CFM
U$22 = FaBo-USB:5077CR-16-SMC2-BK-TR
U$23 = FaBo-ESD:PRTR5V0U2X: Ultra low capacitance double rail to rail ESD protection diode
U$28 = FaBo-BufferIC:74LVC1G125
U$32 = FaBo-Boards:JETSON_NANO
UART2 = FaBo-Connetor:MODULAR-JACK-6P-RJ11_SERIAL_M_USART